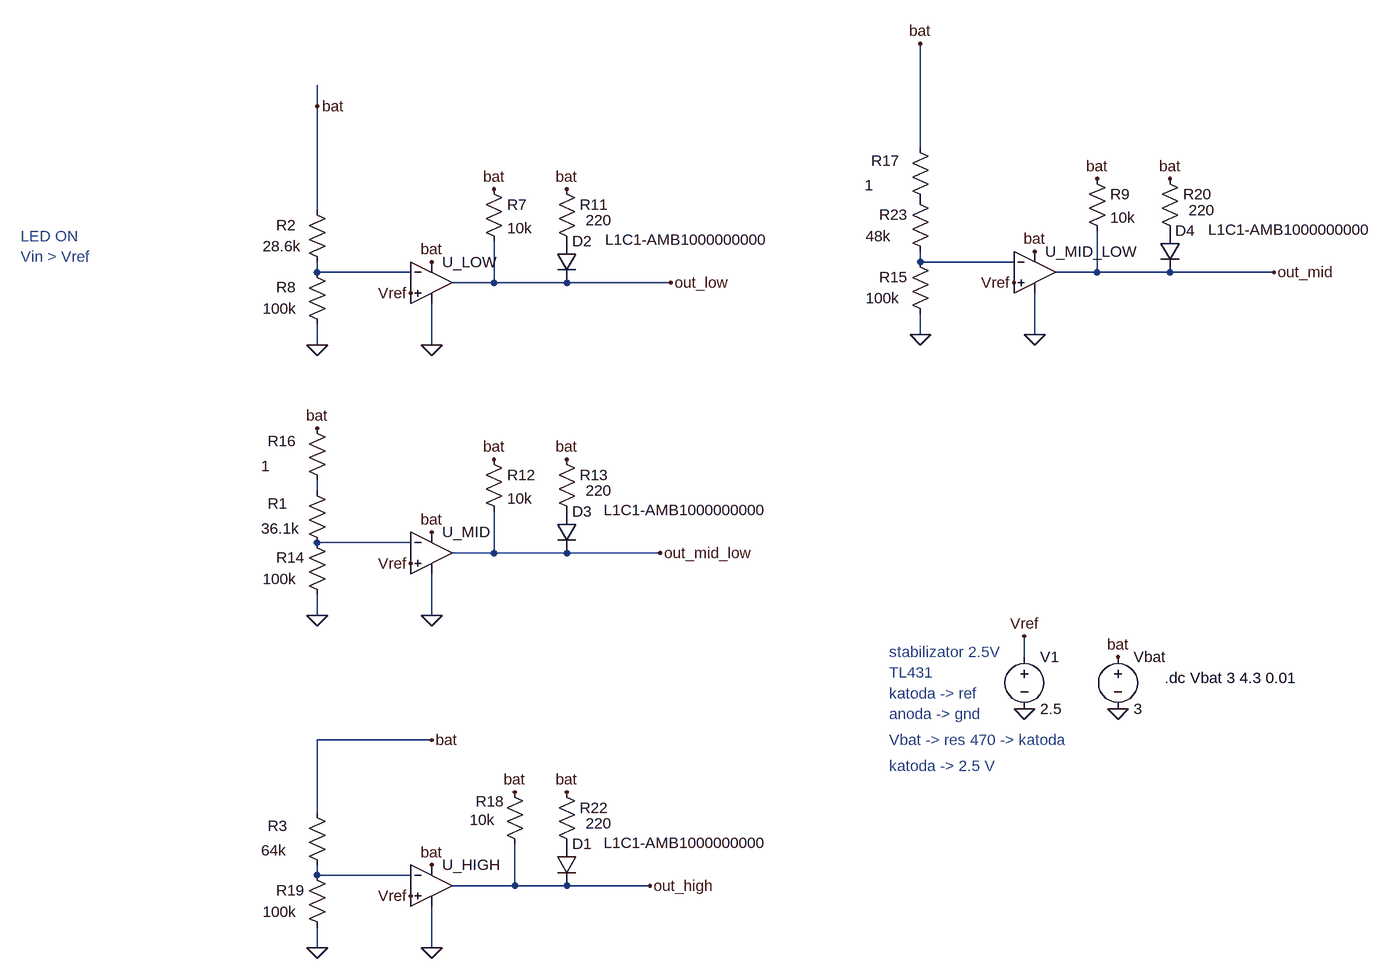
[diagram p0: schematic komparator.asc]
komparator.asc, the LTspice schematic file:
Version 4.1
SHEET 1 1800 1712
WIRE 160 304 160 272
WIRE 1088 368 1088 208
WIRE 160 464 160 304
WIRE 1088 544 1088 528
WIRE 1232 544 1088 544
WIRE 160 560 160 544
WIRE 304 560 160 560
WIRE 1360 560 1360 496
WIRE 1360 560 1296 560
WIRE 1472 560 1360 560
WIRE 1632 560 1472 560
WIRE 432 576 432 512
WIRE 432 576 368 576
WIRE 544 576 432 576
WIRE 704 576 544 576
WIRE 1088 656 1088 624
WIRE 1264 656 1264 592
WIRE 160 672 160 640
WIRE 336 672 336 608
WIRE 160 896 160 880
WIRE 304 976 160 976
WIRE 432 992 432 928
WIRE 432 992 368 992
WIRE 544 992 432 992
WIRE 688 992 544 992
WIRE 160 1088 160 1056
WIRE 336 1088 336 1024
WIRE 1248 1152 1248 1120
WIRE 336 1280 160 1280
WIRE 160 1392 160 1280
WIRE 160 1488 160 1472
WIRE 304 1488 160 1488
WIRE 464 1504 464 1440
WIRE 464 1504 368 1504
WIRE 544 1504 464 1504
WIRE 672 1504 544 1504
WIRE 160 1600 160 1568
WIRE 336 1600 336 1536
FLAG 1248 1120 Vref
FLAG 336 1088 0
FLAG 336 960 bat
FLAG 304 1008 Vref
FLAG 160 1088 0
FLAG 432 848 bat
FLAG 544 848 bat
FLAG 336 1600 0
FLAG 336 1472 bat
FLAG 304 1520 Vref
FLAG 160 1600 0
FLAG 464 1360 bat
FLAG 544 1360 bat
FLAG 336 672 0
FLAG 336 544 bat
FLAG 304 592 Vref
FLAG 160 672 0
FLAG 432 432 bat
FLAG 160 304 bat
FLAG 544 432 bat
FLAG 1392 1152 bat
FLAG 1392 1232 0
FLAG 704 576 out_low
FLAG 672 1504 out_high
FLAG 1248 1232 0
FLAG 160 800 bat
FLAG 1264 656 0
FLAG 1264 528 bat
FLAG 1232 576 Vref
FLAG 1088 656 0
FLAG 1360 416 bat
FLAG 1472 416 bat
FLAG 1632 560 out_mid
FLAG 688 992 out_mid_low
FLAG 1088 208 bat
FLAG 336 1280 bat
SYMBOL OpAmps\\UniversalOpAmp2 336 992 R0
SYMATTR InstName U_MID
SYMBOL res 416 832 R0
SYMATTR InstName R12
SYMATTR Value 10k
SYMBOL res 144 960 R0
WINDOW 0 -47 39 Left 2
WINDOW 3 -68 72 Left 2
SYMATTR InstName R14
SYMATTR Value 100k
SYMBOL res 144 784 R0
WINDOW 0 -60 36 Left 2
WINDOW 3 -70 74 Left 2
SYMATTR InstName R16
SYMATTR Value 1
SYMBOL res 528 832 R0
WINDOW 3 45 64 Left 2
SYMATTR Value 220
SYMATTR InstName R13
SYMBOL diode 528 928 R0
WINDOW 3 73 -2 Left 2
SYMATTR Value L1C1-AMB1000000000
SYMATTR InstName D3
SYMBOL OpAmps\\UniversalOpAmp2 336 1504 R0
SYMATTR InstName U_HIGH
SYMBOL res 448 1344 R0
WINDOW 0 -44 30 Left 2
WINDOW 3 -53 59 Left 2
SYMATTR InstName R18
SYMATTR Value 10k
SYMBOL res 144 1472 R0
WINDOW 0 -47 39 Left 2
WINDOW 3 -68 72 Left 2
SYMATTR InstName R19
SYMATTR Value 100k
SYMBOL res 528 1344 R0
WINDOW 3 45 64 Left 2
SYMATTR Value 220
SYMATTR InstName R22
SYMBOL OpAmps\\UniversalOpAmp2 336 576 R0
SYMATTR InstName U_LOW
SYMBOL res 416 416 R0
SYMATTR InstName R7
SYMATTR Value 10k
SYMBOL res 144 544 R0
WINDOW 0 -47 39 Left 2
WINDOW 3 -68 72 Left 2
SYMATTR InstName R8
SYMATTR Value 100k
SYMBOL res 528 416 R0
WINDOW 3 45 64 Left 2
SYMATTR Value 220
SYMATTR InstName R11
SYMBOL diode 528 512 R0
WINDOW 3 75 -2 Left 2
SYMATTR Value L1C1-AMB1000000000
SYMATTR InstName D2
SYMBOL voltage 1392 1136 R0
WINDOW 123 0 0 Left 0
WINDOW 39 0 0 Left 0
SYMATTR InstName Vbat
SYMATTR Value 3
SYMBOL voltage 1248 1136 R0
WINDOW 123 0 0 Left 0
WINDOW 39 0 0 Left 0
SYMATTR InstName V1
SYMATTR Value 2.5
SYMBOL res 144 880 R0
WINDOW 0 -60 36 Left 2
WINDOW 3 -70 74 Left 2
SYMATTR InstName R1
SYMATTR Value 36.1k
SYMBOL res 144 448 R0
WINDOW 0 -47 39 Left 2
WINDOW 3 -68 72 Left 2
SYMATTR InstName R2
SYMATTR Value 28.6k
SYMBOL res 144 1376 R0
WINDOW 0 -60 36 Left 2
WINDOW 3 -70 74 Left 2
SYMATTR InstName R3
SYMATTR Value 64k
SYMBOL diode 528 1440 R0
WINDOW 3 73 -2 Left 2
SYMATTR Value L1C1-AMB1000000000
SYMATTR InstName D1
SYMBOL OpAmps\\UniversalOpAmp2 1264 560 R0
SYMATTR InstName U_MID_LOW
SYMBOL res 1344 400 R0
SYMATTR InstName R9
SYMATTR Value 10k
SYMBOL res 1072 528 R0
WINDOW 0 -47 39 Left 2
WINDOW 3 -68 72 Left 2
SYMATTR InstName R15
SYMATTR Value 100k
SYMBOL res 1072 352 R0
WINDOW 0 -60 36 Left 2
WINDOW 3 -70 74 Left 2
SYMATTR InstName R17
SYMATTR Value 1
SYMBOL res 1456 400 R0
WINDOW 3 45 64 Left 2
SYMATTR Value 220
SYMATTR InstName R20
SYMBOL diode 1456 496 R0
WINDOW 3 75 -2 Left 2
SYMATTR Value L1C1-AMB1000000000
SYMATTR InstName D4
SYMBOL res 1072 432 R0
WINDOW 0 -47 39 Left 2
WINDOW 3 -68 72 Left 2
SYMATTR InstName R23
SYMATTR Value 48k
TEXT -296 504 Left 2 ;LED ON
TEXT -296 536 Left 2 ;Vin > Vref
TEXT 1464 1184 Left 2 !.dc Vbat 3 4.3 0.01
TEXT 1040 1144 Left 2 ;stabilizator 2.5V
TEXT 1040 1176 Left 2 ;TL431
TEXT 1040 1208 Left 2 ;katoda -> ref
TEXT 1040 1240 Left 2 ;anoda -> gnd
TEXT 1040 1320 Left 2 ;katoda -> 2.5 V
TEXT 1040 1280 Left 2 ;Vbat -> res 470 -> katoda

The netlist it stands for:
* komparator.asc
X§U_MID Vref N004 bat 0 out_mid_low level2 Avol=1Meg GBW=10Meg Slew=10Meg Ilimit=25m Rail=0 Vos=0 En=0 Enk=0 In=0 Ink=0 Rin=500Meg  ; pins In+ In- V+ V- OUT
R12 bat out_mid_low 10k
R14 N004 0 100k
R16 bat N003 1
R13 bat P001 220
D3 P001 out_mid_low L1C1-AMB1000000000
X§U_HIGH Vref N005 bat 0 out_high level2 Avol=1Meg GBW=10Meg Slew=10Meg Ilimit=25m Rail=0 Vos=0 En=0 Enk=0 In=0 Ink=0 Rin=500Meg  ; pins In+ In- V+ V- OUT
R18 bat out_high 10k
R19 N005 0 100k
R22 bat P002 220
X§U_LOW Vref N002 bat 0 out_low level2 Avol=1Meg GBW=10Meg Slew=10Meg Ilimit=25m Rail=0 Vos=0 En=0 Enk=0 In=0 Ink=0 Rin=500Meg  ; pins In+ In- V+ V- OUT
R7 bat out_low 10k
R8 N002 0 100k
R11 bat P003 220
D2 P003 out_low L1C1-AMB1000000000
Vbat bat 0 3
V1 Vref 0 2.5
R1 N003 N004 36.1k
R2 bat N002 28.6k
R3 bat N005 64k
D1 P002 out_high L1C1-AMB1000000000
X§U_MID_LOW Vref N001 bat 0 out_mid level2 Avol=1Meg GBW=10Meg Slew=10Meg Ilimit=25m Rail=0 Vos=0 En=0 Enk=0 In=0 Ink=0 Rin=500Meg  ; pins In+ In- V+ V- OUT
R9 bat out_mid 10k
R15 N001 0 100k
R17 bat P004 1
R20 bat P005 220
D4 P005 out_mid L1C1-AMB1000000000
R23 P004 N001 48k
.model D D
.lib standard.dio
* LED ON
* Vin > Vref
.dc Vbat 3 4.3 0.01
* stabilizator 2.5V
* TL431
* katoda -> ref
* anoda -> gnd
* katoda -> 2.5 V
* Vbat -> res 470 -> katoda
.lib UniversalOpAmp2.lib
.backanno
.end

* Results of the author's LTspice run, read from the files saved beside the schematic
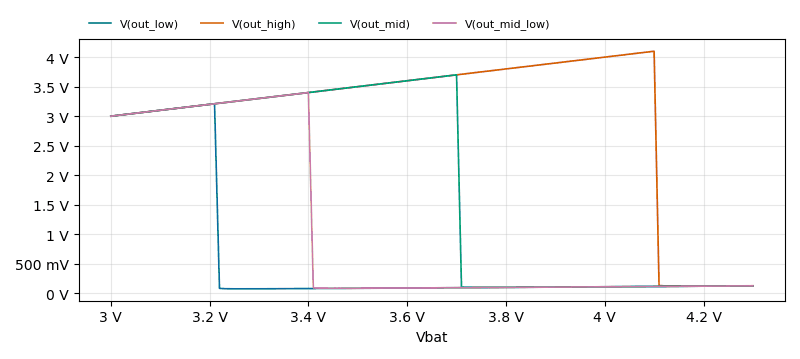
[diagram p1: DC transfer characteristic of komparator.asc, plotted from the saved traces]
* DC transfer characteristic, 1 run:
*   V(out_low): 3 V at Vbat=3 V, 127.8 mV at Vbat=4.3 V, min 76.99 mV, max 3.21 V
*   V(out_high): 3 V at Vbat=3 V, 128.9 mV at Vbat=4.3 V, min 124.4 mV, max 4.1 V
*   V(out_mid): 3 V at Vbat=3 V, 127.9 mV at Vbat=4.3 V, min 102.2 mV, max 3.7 V
*   V(out_mid_low): 3 V at Vbat=3 V, 127.8 mV at Vbat=4.3 V, min 86.54 mV, max 3.4 V